# Altium schematic sheet 05_USB_PORTS.SchDoc: USB Host and Device Ports
size 381 x 266 mm; Organization: Meteroi; Address1: Room 428, 410 Guiping Rd.; Address2: Shanghai 200233, CHINA; SheetNumber: 5; SheetTotal: 9; PageSetup: Record=PageOptions|CenterHorizontal=True|CenterVertical=True|PrintScale=0.75|XCorrection=1.00|YCorrection=1.00|PrintKind=2|BorderSize=5000000|LeftOffset=0|BottomOffset=0|Orientation=2|PaperLength=1000|PaperWidth=1000|Scale=100|PaperSource=276|PrintQuality=-3|MediaType=1|DitherType=10|PaperKind=A4|PrintScaleMode=1
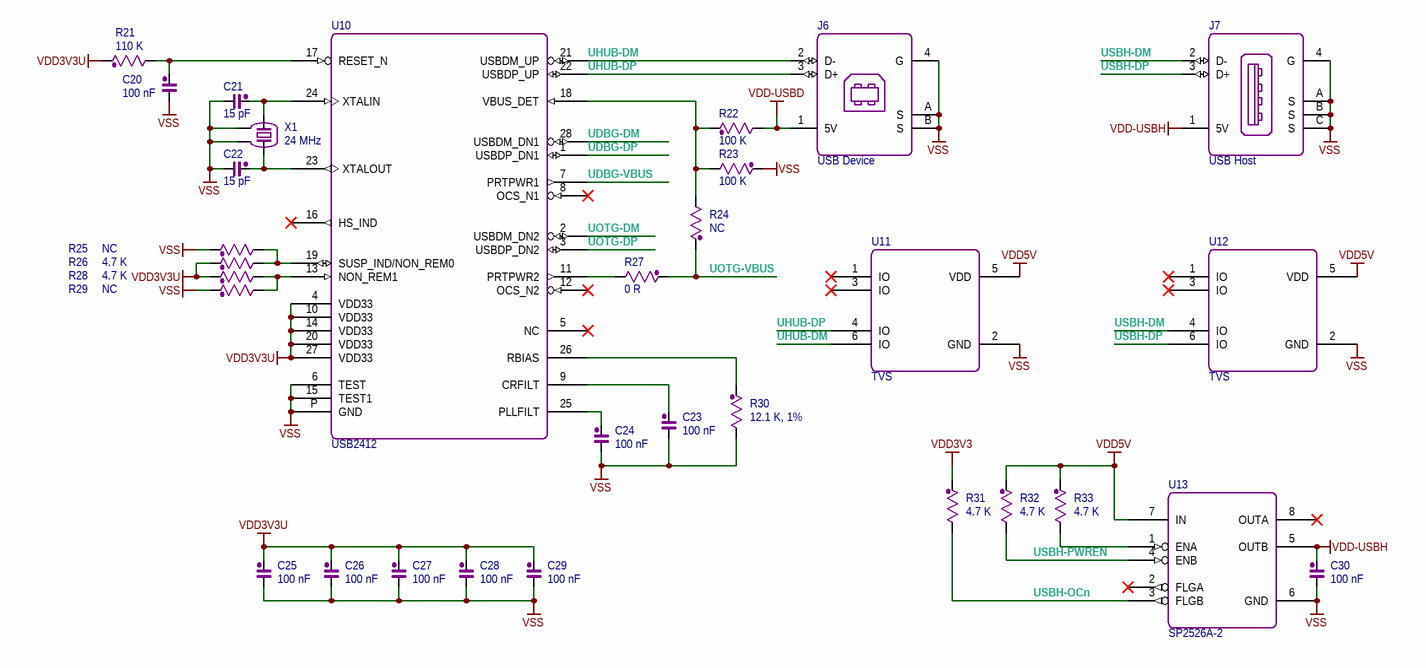
[diagram p0: 05_USB_PORTS.SchDoc]

## Parts
C20  100 nF  [0402A1]
C21  15 pF  [0402A1]
C22  15 pF  [0402A1]
C23  100 nF  [0402A1]
C24  100 nF  [0402A1]
C25  100 nF  [0402A1]
C26  100 nF  [0402A1]
C27  100 nF  [0402A1]
C28  100 nF  [0402A1]
C29  100 nF  [0402A1]
C30  100 nF  [0603A1]
J6  USB Device  [USBD1A]
J7  USB Host  [USBH1C]
R21  110 K  [0402A2]
R22  100 K  [0603A2]
R23  100 K  [0603A2]
R24  NC  [0603A2]
R25  NC  [0402A2]
R26  4.7 K  [0402A2]
R27  0 R  [0603A2]
R28  4.7 K  [0402A2]
R29  NC  [0402A2]
R30  12.1 K, 1%  [0402A2]
R31  4.7 K  [0603A2]
R32  4.7 K  [0603A2]
R33  4.7 K  [0603A2]
U10  USB2412  [QFN-5-28]
U11  TVS  [SOT-23-6]
U12  TVS  [SOT-23-6]
U13  SP2526A-2  [SOIC-8S]
X1  24 MHz  [OSC_4A_S_3225]

## Nets
VDD3V3: R31.2
VDD3V3U: C25.2 C26.2 C27.2 C28.2 C29.2 R21.2 R26.2 R28.2 U10.4(VDD33) U10.10(VDD33) U10.14(VDD33) U10.20(VDD33) U10.27(VDD33)
VDD5V: R32.2 R33.2 U11.5(VDD) U12.5(VDD) U13.7(IN)
VDD-USBD: J6.1(5V) R22.1
VDD-USBH: C30.2 J7.1(5V) U13.5(OUTB)
VSS: C20.1 C21.1 C22.1 C23.1 C24.1 C25.1 C26.1 C27.1 C28.1 C29.1 C30.1 J6.4(G) J6.A(S) J6.B(S) J7.4(G) J7.A(S) J7.B(S) J7.C(S) R23.2 R25.2 R29.2 R30.1 U10.6(TEST) U10.15(TEST1) U10.P(GND) U11.2(GND) U12.2(GND) U13.6(GND) X1.2 X1.4
UDBG-DM: U10.28(USBDM_DN1)
UDBG-DP: U10.1(USBDP_DN1)
UDBG-VBUS: U10.7(PRTPWR1)
UHUB-DM: J6.2(D-) U10.21(USBDM_UP) U11.6(IO)
UHUB-DP: J6.3(D+) U10.22(USBDP_UP) U11.4(IO)
UOTG-DM: U10.2(USBDM_DN2)
UOTG-DP: U10.3(USBDP_DN2)
UOTG-VBUS: R24.2 R27.2
USBH-DM: J7.2(D-) U12.4(IO)
USBH-DP: J7.3(D+) U12.6(IO)
USBH-OCn: R31.1 U13.3(FLGB)
USBH-PWREN: R32.1 U13.4(ENB)
NetC20_2: C20.2 R21.1 U10.17(RESET_N)
NetC21_2: C21.2 U10.24(XTALIN) X1.3
NetC22_2: C22.2 U10.23(XTALOUT) X1.1
NetC23_2: C23.2 U10.9(CRFILT)
NetC24_2: C24.2 U10.25(PLLFILT)
NetR22_2: R22.2 R23.1 R24.1 U10.18(VBUS_DET)
NetR25_1: R25.1 R26.1 U10.19(SUSP_IND/NON_REM0)
NetR27_1: R27.1 U10.11(PRTPWR2)
NetR28_1: R28.1 R29.1 U10.13(NON_REM1)
NetR30_2: R30.2 U10.26(RBIAS)
NetR33_1: R33.1 U13.1(ENA)

Not connected (* = marked no-connect by the designer): U10 5(NC)* 8(OCS_N1)* 12(OCS_N2)* 16(HS_IND)*; U11 1(IO)* 3(IO)*; U12 1(IO)* 3(IO)*; U13 2(FLGA)* 8(OUTA)*

## Notes on the sheet
- Title:
- Project:
- Sheet:
- Of
- Size:
- D/N:
- Rev:
- Date:
- P/N:
- S/N:
- Designer:
- C

## Library data of the parts
C20-C30 = CAP: Normal Capacitor; PartNumber: 0; Vendor: muRata; Designer: shyul; PinCountSMD: 2; SerialNumber: 0; Publisher: Cowin; PCBMarker: Capacitor; Version: 1.0; VersionDate: 04-27-2011; PinCountHole: 0
  C20 C23-C30: Value: 100 nF
  C21 C22: Value: 15 pF
J6 = USBD_JACK: USB Device Jack; Vendor: Foxconn; PartNumber: *; PCBMarker: *; SerialNumber: *
J7 = USBH_JACK: USB Host Jack; Vendor: Foxconn; PartNumber: *; PCBMarker: USB Host; SerialNumber: *
R21-R33 = RES: Normal Resistor; PartNumber: 0; Vendor: KOA; Designer: shyul; PinCountSMD: 2; SerialNumber: 0; Version: 1.0; VersionDate: 04-27-2011; PCBMarker: Resistor; Publisher: Cowin; PinCountHole: 0
  R21: Value: 110 K
  R22 R23: Value: 100 K
  R24 R25 R29: Value: NC
  R26 R28 R31-R33: Value: 4.7 K
  R27: Value: 0 R
  R30: Value: 12.1 K, 1%
U10 = USB2412: Embedded USB Hub; PartNumber: USB2412-DZK; Vendor: SMSC; PinCountSMD: 29; PinCountHole: 0; Designer: shyul; PCBMarker: PHY; Value: USB2412; Version: 1.0; VersionDate: 03-26-2012; SerialNumber: 0; Publisher: Cowin
U11 U12 = ESD_4A: 4-way TVS Diodes; PartNumber: LXES2SBAA4-016; Vendor: muRata; Designer: shyul; PinCountSMD: 6; PinCountHole: 0; SerialNumber: *; Publisher: Cowin; PCBMarker: *; Value: TVS; Version: 1.0; VersionDate: 04-28-2011
U13 = SP2526A-2: Power Switch; PartNumber: SP2526A-2EN; Vendor: EXAR; PinCountSMD: 29; PinCountHole: 0; Designer: shyul; PCBMarker: PHY; Value: SP2526A-2; Version: 1.0; VersionDate: 03-26-2012; SerialNumber: 0; Publisher: Cowin
X1 = OSC_2B: Crystal; PartNumber: 0; Vendor: KDS; Designer: shyul; PinCountSMD: 4; Value: 24 MHz; SerialNumber: 0; Publisher: Cowin; PCBMarker: Crystal; Version: 1.0; VersionDate: 04-29-2011; PinCountHole: 0